# EAGLE design tc4-controller-01 (EAGLE 5.10)
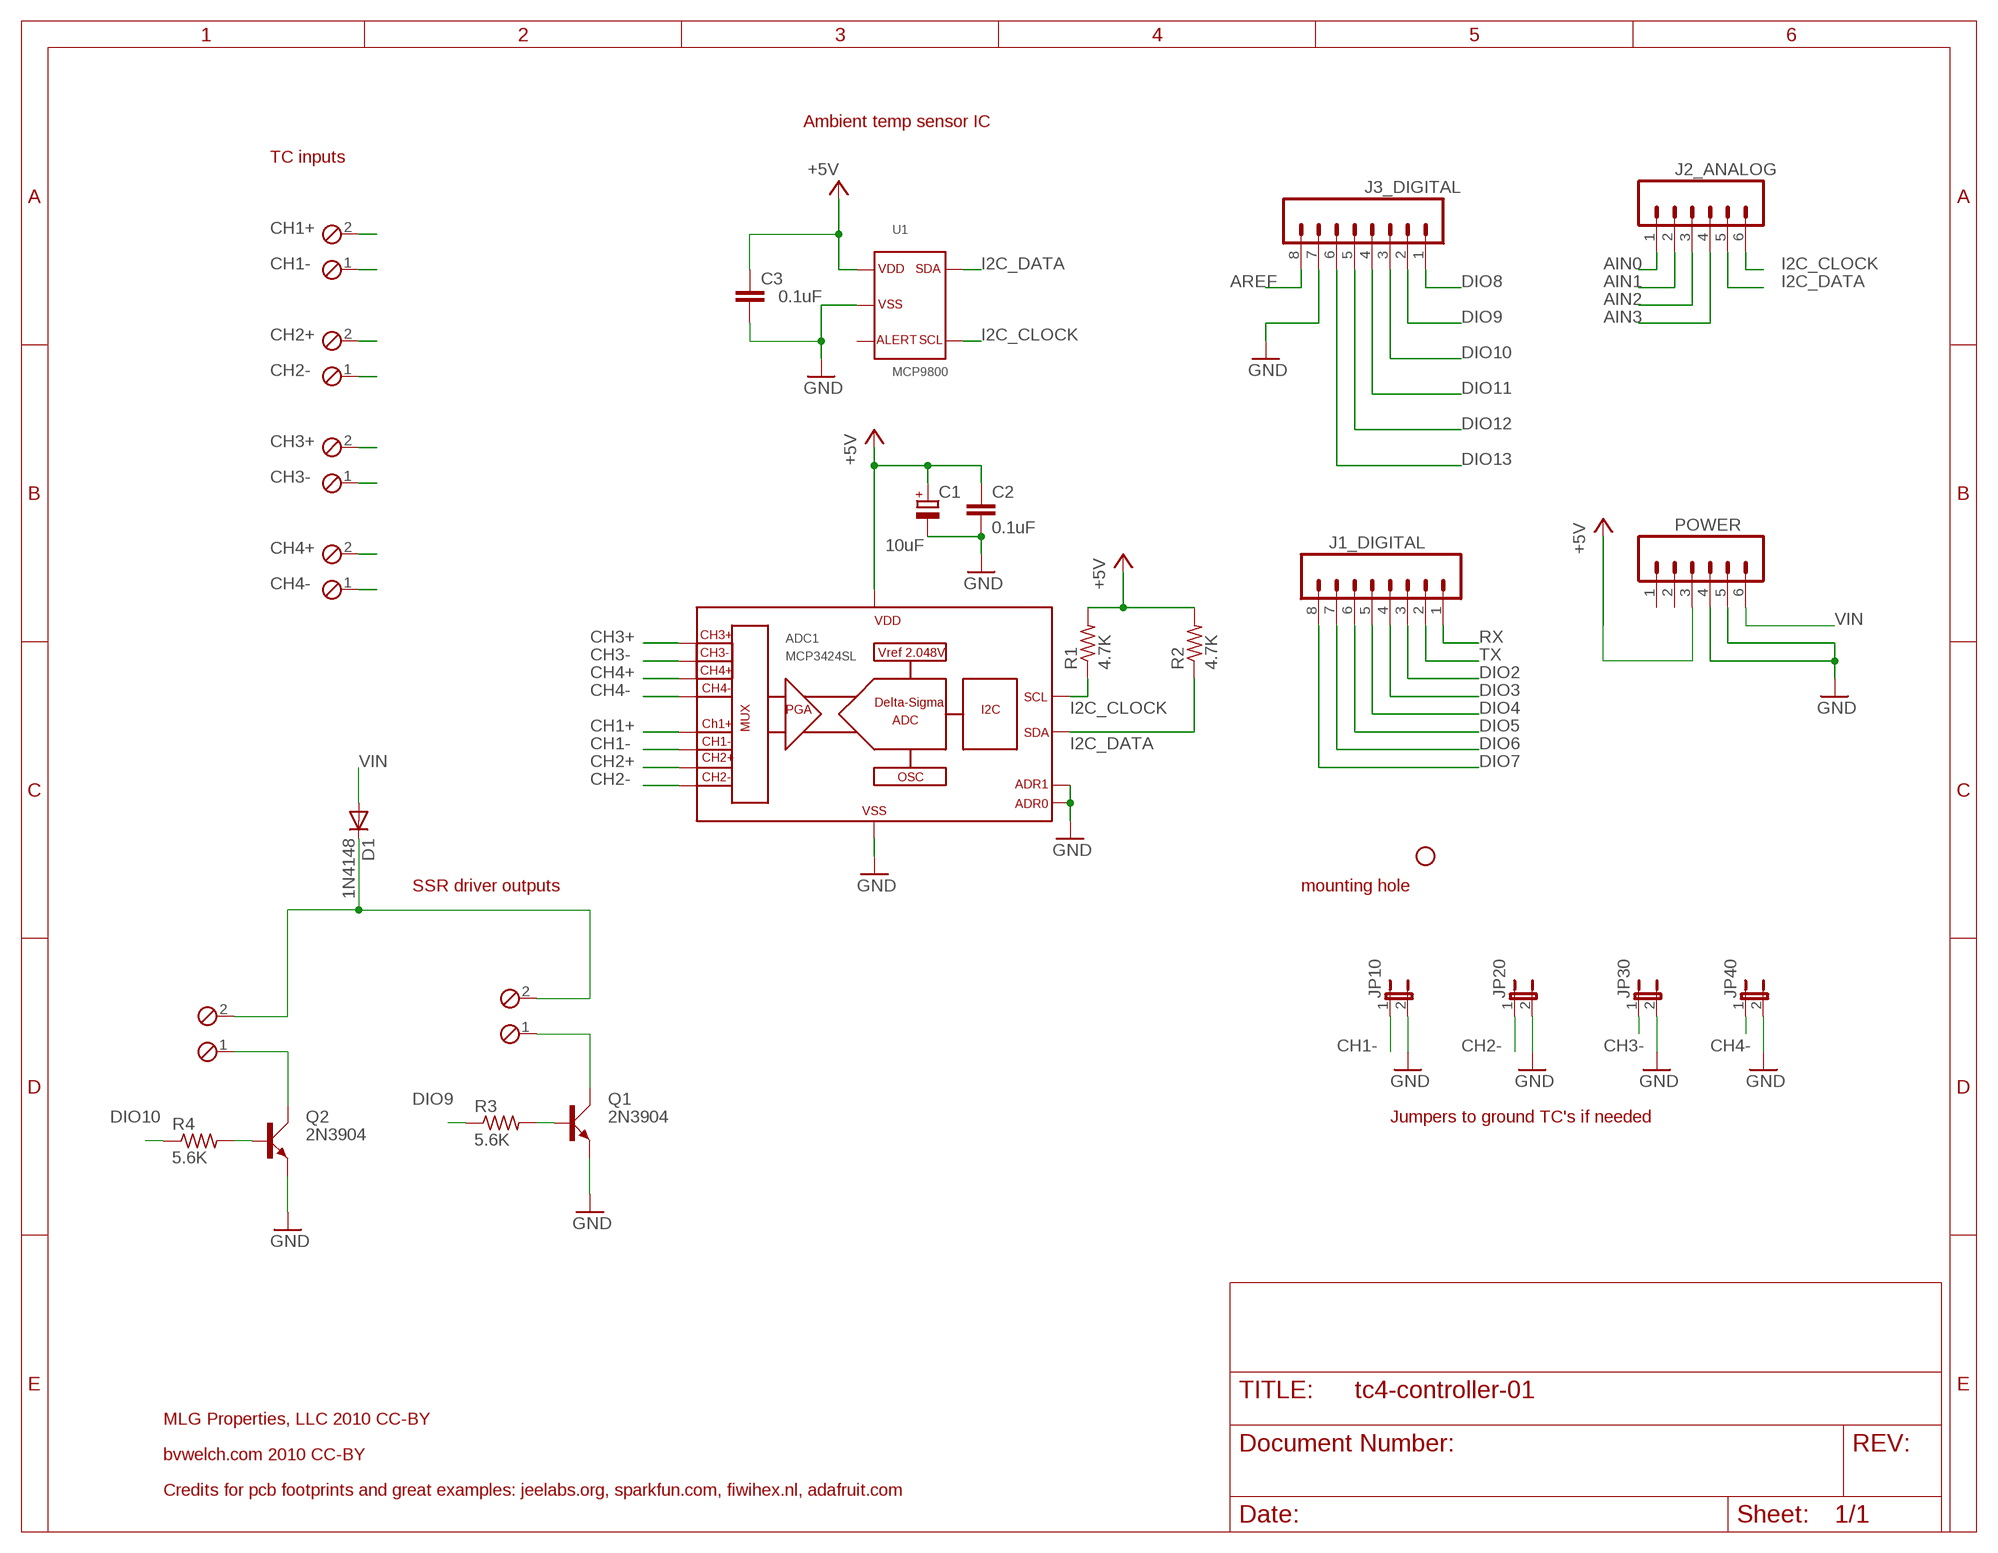
[diagram p0: schematic, sheet 1]

## Parts
ADC1  MCP3424SL  [SO14]
C1  10uF  CPOL-EUE2,5-6E  [E2,5-6E]
C2  0.1uF  C-EU025-025X050  [C025-025X050]
C3  0.1uF  C-EU025-025X050  [C025-025X050]
D1  1N4148  1N4148DO35-7  [DO35-7]
J1_DIGITAL  M08  [1X08]
J2_ANALOG  M06SIP  [1X06]
J3_DIGITAL  M08  [1X08]
JP1  STAND-OFF  [STAND-OFF]
JP10  JP1E  [JP1]
JP20  JP1E  [JP1]
JP30  JP1E  [JP1]
JP40  JP1E  [JP1]
OT1  MPT2  [2POL254]
OT2  MPT2  [2POL254]
POWER  M06SIP  [1X06]
Q1  2N3904  [TO92D]
Q2  2N3904  [TO92D]
R1  4.7K  R-US_0204/7  [0204/7]
R2  4.7K  R-US_0204/7  [0204/7]
R3  5.6K  R-US_0204/7  [0204/7]
R4  5.6K  R-US_0204/7  [0204/7]
TC1  MPT2  [2POL254]
TC2  MPT2  [2POL254]
TC3  MPT2  [2POL254]
TC4  MPT2  [2POL254]
U1  MCP9800  [SOT23-5L]

## Nets
+5V: ADC1.6 C1.+ C2.1 C3.1 POWER.3 R1.2 R2.2 U1.1
AIN0: J2_ANALOG.1
AIN1: J2_ANALOG.2
AIN2: J2_ANALOG.3
AIN3: J2_ANALOG.4
AREF: J3_DIGITAL.8
CH1+: ADC1.1 TC1.2
CH1-: ADC1.2 JP10.1 TC1.1
CH2+: ADC1.3 TC2.2
CH2-: ADC1.4 JP20.1 TC2.1
CH3+: ADC1.11 TC3.2
CH3-: ADC1.12 JP30.1 TC3.1
CH4+: ADC1.13 TC4.2
CH4-: ADC1.14 JP40.1 TC4.1
DIO2: J1_DIGITAL.3
DIO3: J1_DIGITAL.4
DIO4: J1_DIGITAL.5
DIO5: J1_DIGITAL.6
DIO6: J1_DIGITAL.7
DIO7: J1_DIGITAL.8
DIO8: J3_DIGITAL.1
DIO9: J3_DIGITAL.2 R3.1
DIO10: J3_DIGITAL.3 R4.1
DIO11: J3_DIGITAL.4
DIO12: J3_DIGITAL.5
DIO13: J3_DIGITAL.6
GND: ADC1.5 ADC1.9 ADC1.10 C1.- C2.2 C3.2 J3_DIGITAL.7 JP10.2 JP20.2 JP30.2 JP40.2 POWER.4 POWER.5 Q1.E Q2.E U1.2
I2C_CLOCK: ADC1.8 J2_ANALOG.6 R1.1 U1.4
I2C_DATA: ADC1.7 J2_ANALOG.5 R2.1 U1.5
N$1: OT2.1 Q2.C
N$2: OT1.1 Q1.C
N$3: Q2.B R4.2
N$4: Q1.B R3.2
N$5: D1.C OT1.2 OT2.2
RX: J1_DIGITAL.1
TX: J1_DIGITAL.2
VIN: D1.A POWER.6
Unconnected: POWER.1 POWER.2 U1.3

## Notes on the sheet
- Ambient temp sensor IC
- TC inputs
- SSR driver outputs | mounting hole
- Jumpers to ground TC's if needed
- MLG Properties, LLC 2010 CC-BY
- bvwelch.com 2010 CC-BY
- Credits for pcb footprints and great examples: jeelabs.org, sparkfun.com, fiwihex.nl, adafruit.com

## Library data of the parts
ADC1 = newparts_2010:MCP3424: 18-bit multi-channel delta-sigma AD converter with I2C interface. Microchip. Farnell 1630424
C1 = rcl:CPOL-EU: POLARIZED CAPACITOR, European symbol
C2 C3 = rcl:C-EU: CAPACITOR, European symbol
D1 = diode:1N4148: DIODE high speed (Philips)
J1_DIGITAL J3_DIGITAL = SparkFun:M08: Header 8 Standard 8-pin 0.1" header. Use with straight break away headers (SKU : PRT-00116), right angle break away headers (PRT-00553), swiss pins (PRT-00743), machine pins (PRT-00117), and female headers (PRT-00115).
J2_ANALOG POWER = SparkFun:M06: Header 6 Standard 6-pin 0.1" header. Use with straight break away headers (SKU : PRT-00116), right angle break away headers (PRT-00553), swiss pins (PRT-00743), machine pins (PRT-00117), and female headers (PRT-00115). Molex polarized connector foot print use with SKU : PRT-08094 with associated crimp pins and housings. NOTES ON THE VARIANTS LOCK and LOCK_LONGPADS... This footprint was designed to help hold the alignment of a through-hole component (i.e. 6-pin header) while soldering it into place. You may notice that each hole has been shifted either up or down by 0.005 of an inch from it's more standard position (which is a perfectly straight line). This slight alteration caused the pins (the squares in the middle) to touch the edges of the holes. Because they are alternating, it causes a "brace" to hold the component in place. 0.005 has proven to be the perfect amount of "off-center" position when using our standard breakaway headers. Although looks a little odd when you look at the bare footprint, once you have a header in there, the alteration is very hard to notice. Also, if you push a header all the way into place, it is covered up entirely on the bottom side. This idea of altering the position of holes to aid alignment will be further integrated into the Sparkfun Library for other footprints. It can help hold any component with 3 or more connection pins.
JP1 = SparkFun:STAND-OFF: Stand Off This is the mechanical footprint for a #4 phillips button head screw. Use the keepout ring to avoid running the screw head into surrounding components. SKU : PRT-00447
JP10 JP20 JP30 JP40 = jumper:JP1E: JUMPER
OT1 OT2 TC1-TC4 = newparts_2006:MPT2: PHOENIX CONNECTOR
Q1 Q2 = transistor-small-signal:2N3904: NPN TRANSISTOR
R1-R4 = rcl:R-US_: RESISTOR, American symbol
U1 = newparts_2010:MCP9800: Temperature sensor I2C output, Microchip. Farnell 1439485

## Board
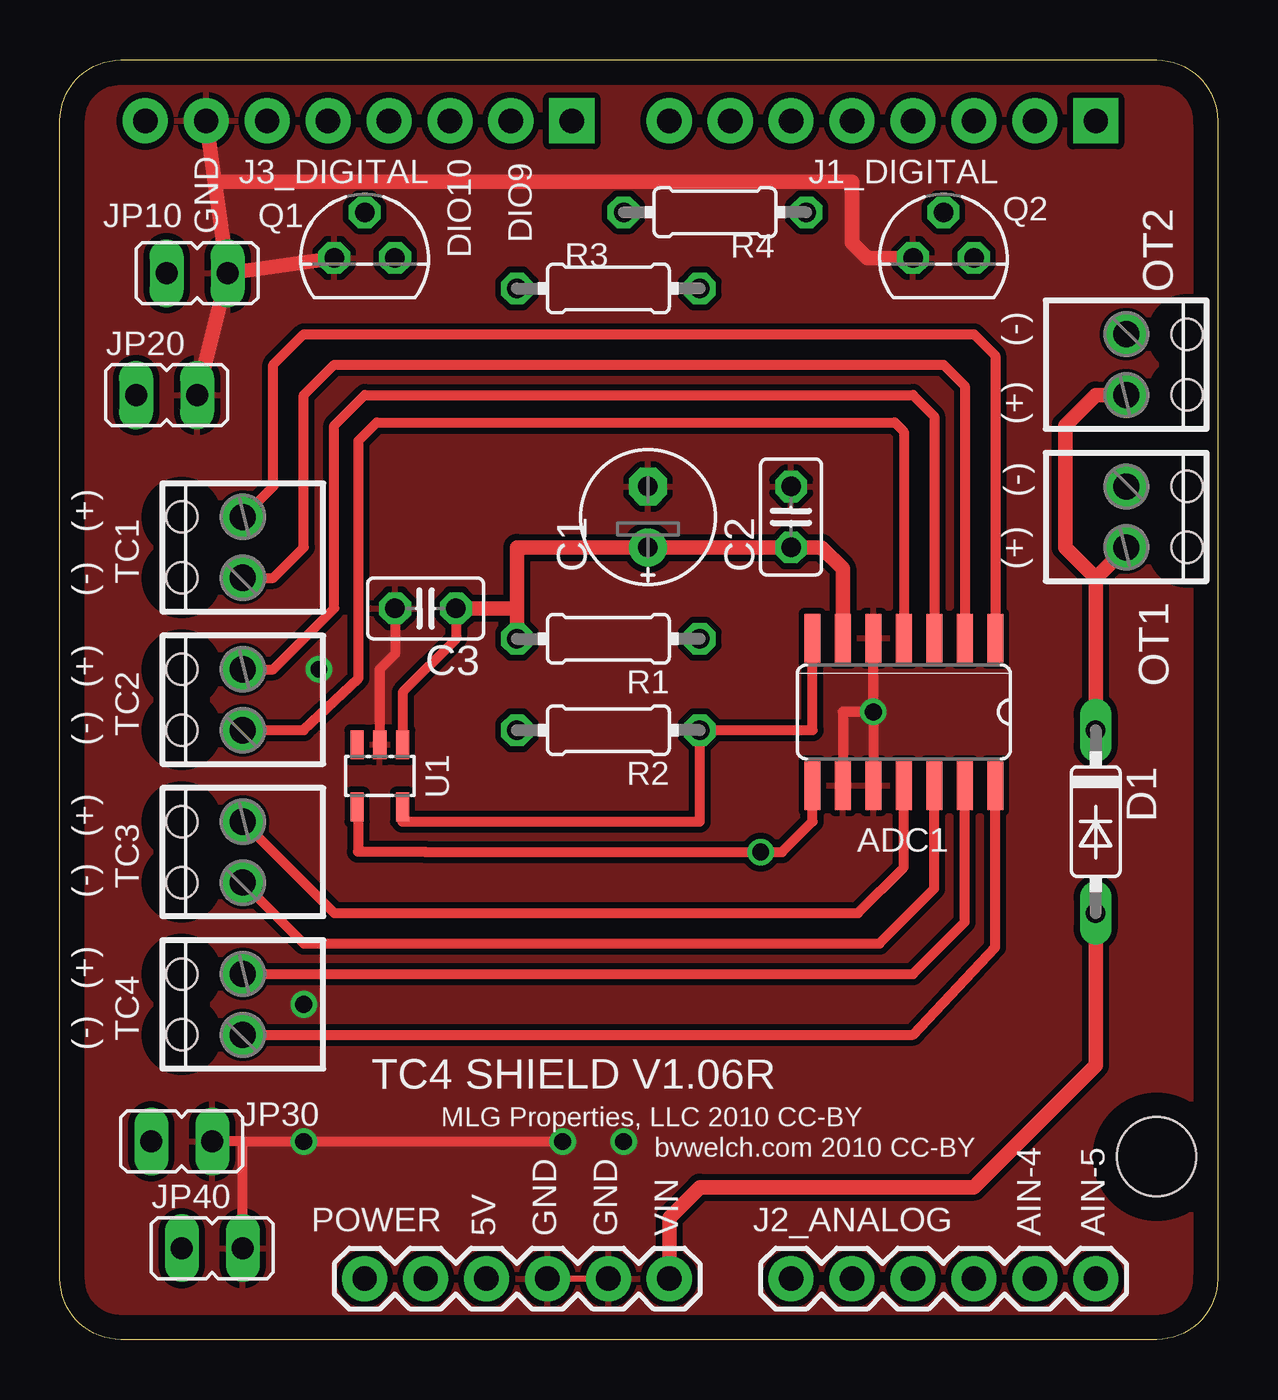
[diagram p1: board, top side]
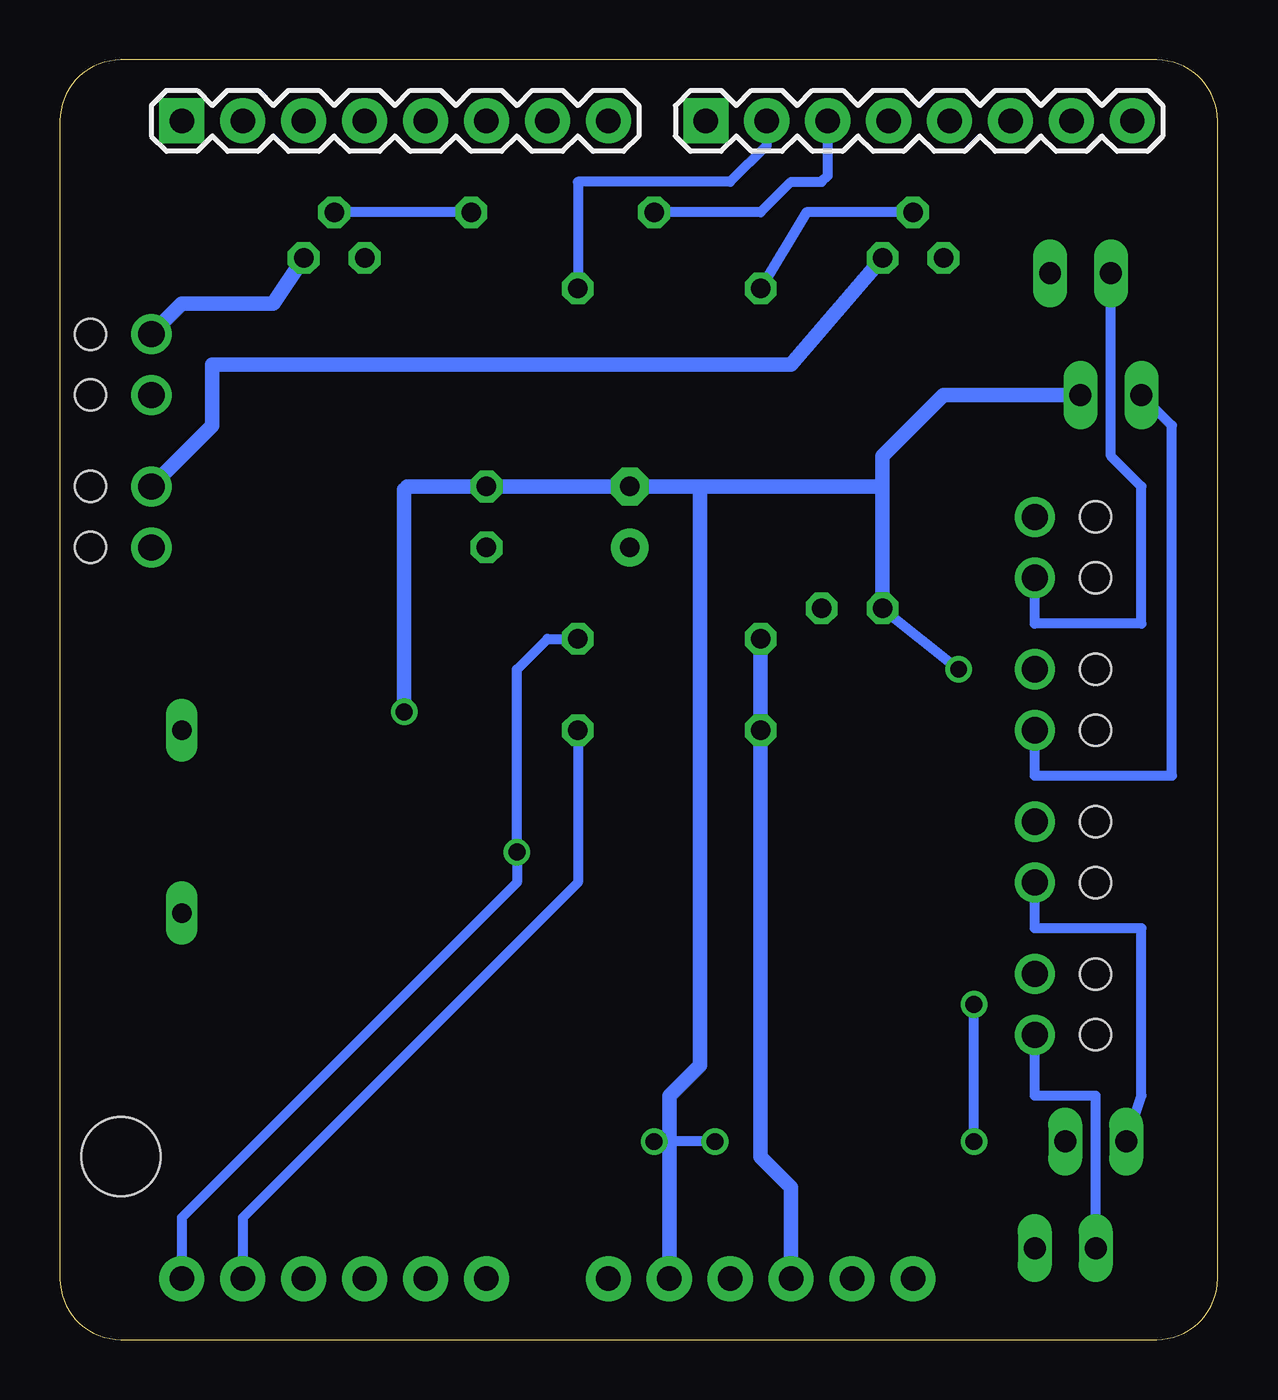
[diagram p2: board, bottom side, seen from below]

Size 48.26 x 53.34 mm. Coordinates in mm from the lower left corner, seen from the top.
Outline: 2.54,0 arc-90 0,2.54 0,50.8 arc-90 2.54,53.34 45.72,53.34 arc-90 48.26,50.8 48.26,2.54 arc-90 45.72,0 2.54,0
Copper layers (1*16): Top 0.035mm / dielectric 1.5mm / Bottom 0.035mm
Design rules "Olimex10mils": minimum track width 10mil, minimum drill 24mil, track to track 10mil, track to pad 10mil, pad to pad 10mil, via to via 10mil, smd to smd 10mil, copper to edge 40mil, drill to drill 10mil, minimum pad ring 10mil, minimum via ring 8mil, stop-mask expansion 0mil, vias tented up to drill 0mil, thermal gap 10mil

### Footprints (pad centres in the part's own frame; a part is rotated, then mirrored left to right if it is on the bottom)
SO14 = smd 0.66 x 2.032: 1 -3.81,-3.073; 2 -2.54,-3.073; 3 -1.27,-3.073; 4 0,-3.073; 5 1.27,-3.073; 6 2.54,-3.073; 7 3.81,-3.073; 8 3.81,3.073; 9 2.54,3.073; 10 1.27,3.073; 11 0,3.073; 12 -1.27,3.073; 13 -2.54,3.073; 14 -3.81,3.073
E2,5-6E = drill 0.813 pad 1.575 round: + -1.27,0 | drill 0.813 pad 1.575 octagon: - 1.27,0
C025-025X050 = drill 0.813 octagon: 1 -1.27,0; 2 1.27,0
DO35-7 = drill 0.813 long: A 3.81,0; C -3.81,0
1X08 = drill 1.016 pad 1.88 square: 1 0,0 | drill 1.016 pad 1.88 round: 2 2.54,0; 3 5.08,0; 4 7.62,0; 5 10.16,0; 6 12.7,0; 7 15.24,0; 8 17.78,0
1X06 = drill 1.016 pad 1.88 round: 1 0,0; 2 2.54,0; 3 5.08,0; 4 7.62,0; 5 10.16,0; 6 12.7,0
STAND-OFF = hole 3.302: 0,0
JP1 = drill 0.914 long: 1 0,-1.27; 2 0,1.27
2POL254 = drill 1.092 pad 1.676 round: 1 -1.27,0; 2 1.27,0 | hole 1.295: -1.27,2.54; 1.27,2.54
TO92D = drill 0.813 octagon: B 0,1.905; C 1.27,0; E -1.27,0
0204/7 = drill 0.813 octagon: 1 -3.81,0; 2 3.81,0
SOT23-5L = smd 0.55 x 1.2: 1 -0.95,-1.3; 2 0,-1.3; 3 0.95,-1.3; 4 0.95,1.3; 5 -0.95,1.3

### Placement (x,y rotation side)
ADC1  35.18,26.16 180 top
C1  24.51,34.29 90 top
C2  30.48,34.29 90 top
C3  15.24,30.48 180 top
D1  43.18,21.59 270 top
J1_DIGITAL  43.18,50.8 0 bottom
J2_ANALOG  30.48,2.54 0 top
J3_DIGITAL  21.34,50.8 0 bottom
JP1  45.72,7.62 180 top
JP10  5.71,44.45 270 top
JP20  4.45,39.37 270 top
JP30  5.08,8.26 270 top
JP40  6.35,3.81 270 top
OT1  44.45,34.29 270 top
OT2  44.45,40.64 270 top
POWER  12.7,2.54 0 top
Q1  12.7,45.09 0 top
Q2  36.83,45.09 0 top
R1  22.86,29.21 180 top
R2  22.86,25.4 180 top
R3  22.86,43.81 180 top
R4  27.3,46.99 0 top
TC1  7.62,33.02 90 top
TC2  7.62,26.67 90 top
TC3  7.62,20.32 90 top
TC4  7.62,13.97 90 top
U1  13.34,23.5 180 top

### Tracks (layer width: path | path; a pad name or v marks a point on that pad's centre or on a via)
+5V
  Top 0.406: U1.1 14.28,26.98 16.51,29.21 C3.1
  Top 0.61: ADC1.6 32.64,32.13 31.75,33.02 C2.1 C1.+ 19.05,33.02 19.05,30.48 | R1.2 19.05,30.48 | 19.05,30.48 C3.1
  Bottom 0.61: R1.2 R2.2 19.05,7.62 17.78,6.35 POWER.3
CH1+
  Top 0.406: ADC1.1 38.99,41.02 38.1,41.91 10.16,41.91 8.89,40.64 8.89,35.56 TC1.2
CH1-
  Top 0.406: TC1.1 8.89,31.75 10.16,33.02 10.16,39.37 11.43,40.64 36.83,40.64 37.72,39.75 ADC1.2
  Bottom 0.406: JP10.1 4.45,36.83 3.18,35.56 3.18,29.84 7.62,29.84 TC1.1
CH2+
  Top 0.406: ADC1.3 36.45,38.48 35.56,39.37 12.7,39.37 11.43,38.1 11.43,30.48 8.89,27.94 TC2.2
CH2-
  Top 0.406: TC2.1 10.16,25.4 12.45,27.56 12.45,37.47 13.21,38.23 34.8,38.23 35.18,37.85 ADC1.4
  Bottom 0.406: TC2.1 7.62,23.5 1.91,23.5 1.91,38.1 JP20.1
CH3+
  Top 0.406: ADC1.11 35.18,19.68 33.27,17.78 11.43,17.78 TC3.2
CH3-
  Top 0.406: 7.88,18.79 TC3.1 10.16,16.51 34.16,16.51 36.45,18.8 ADC1.12
  Bottom 0.406: TC3.1 7.62,17.14 3.18,17.14 3.18,10.16 JP30.1
CH4+
  Top 0.406: TC4.2 35.56,15.24 37.72,17.4 ADC1.13
CH4-
  Top 0.406: TC4.1 35.56,12.7 38.99,16.36 ADC1.14
  Bottom 0.406: JP40.1 5.08,10.16 7.62,10.16 TC4.1
DIO9
  Bottom 0.406: J3_DIGITAL.2 18.8,49.78 20.32,48.26 26.67,48.26 R3.1
DIO10
  Bottom 0.406: R4.1 19.05,46.99 17.78,48.26 16.51,48.26 16.26,48.51 J3_DIGITAL.3
GND  (via drill 0.7)
  Top 0.254: POWER.5 POWER.4
  Top 0.406: ADC1.9 32.64,26.16 v33.91,26.16 | v33.91,26.16 ADC1.10 | v33.91,26.16 33.91,28.7 | 7.62,8.26 JP30.2 | 7.62,8.26 v10.16,8.26 v20.95,8.26 | JP40.2 7.62,8.26 | U1.2 13.34,27.94 13.97,28.57 C3.2
  Top 0.61: JP20.2 JP10.2 | JP10.2 Q1.E | JP10.2 6.45,48.27 | 6.45,48.27 J3_DIGITAL.7 | Q2.E 33.66,45.09 33.02,45.72 33.02,48.26 6.46,48.26 6.45,48.27
  Bottom 0.406: 33.78,35.56 33.91,35.43 | v20.95,8.26 22.86,8.26 v23.49,8.26 | C3.2 v10.79,27.94 | v10.16,8.26 v10.16,13.97
  Bottom 0.61: POWER.5 22.86,8.26 22.86,10.16 21.59,11.43 21.59,35.56 | 33.78,35.56 C2.2 C1.- 21.59,35.56 | 33.91,35.43 v33.91,26.16 | 21.59,35.56 13.97,35.56 | 13.97,35.56 C3.2 | 13.97,35.56 13.97,36.83 11.43,39.37 JP20.2
  pour Top: 3.18,52.7 arc90 0.63,50.16 0.63,3.17 arc90 3.18,0.64 45.09,0.64 arc90 47.62,3.17 47.62,50.16 arc90 45.09,52.7
I2C_CLOCK  (via drill 0.7)
  Top 0.406: ADC1.8 31.37,21.59 30.1,20.32 v29.21,20.32 15.24,20.32 15.24,20.34 12.42,20.34 12.42,22.2 U1.4
  Bottom 0.406: J2_ANALOG.6 43.18,5.08 29.21,19.05 v29.21,20.32 29.21,27.94 27.94,29.21 R1.1
I2C_DATA
  Top 0.406: ADC1.7 31.37,25.4 R2.1 26.67,21.59 14.27,21.59 14.27,21.67 14.28,21.67 U1.5
  Bottom 0.406: R2.1 26.67,19.05 40.64,5.08 J2_ANALOG.5
N$1
  Bottom 0.61: Q2.C 39.37,43.18 43.18,43.18 OT2.1
N$2
  Bottom 0.61: Q1.C 17.78,40.64 41.91,40.64 41.91,38.1 OT1.1
N$3
  Bottom 0.406: R4.2 Q2.B
N$4
  Bottom 0.406: Q1.B 17.15,46.99 R3.2
N$5
  Top 0.61: D1.C 43.18,31.75 | 43.18,31.75 OT1.2 | OT2.2 43.18,39.37 41.91,38.1 41.91,33.02 43.18,31.75
VIN
  Top 0.61: D1.A 43.18,11.43 38.1,6.35 26.67,6.35 25.4,5.08 POWER.6

### Text on the board
tNames: GND | DIO9 | DIO10 | (-) | (+) | (-) | (+) | (+) | (-) | (+) | (-) | (+) | (-) | (+) | (-) | TC4 SHIELD V1.06R | MLG Properties, LLC 2010 CC-BY | bvwelch.com 2010 CC-BY | 5V | GND | GND | VIN | AIN-4 | AIN-5